# EAGLE design 113_ir_receive (EAGLE 9.6.0)
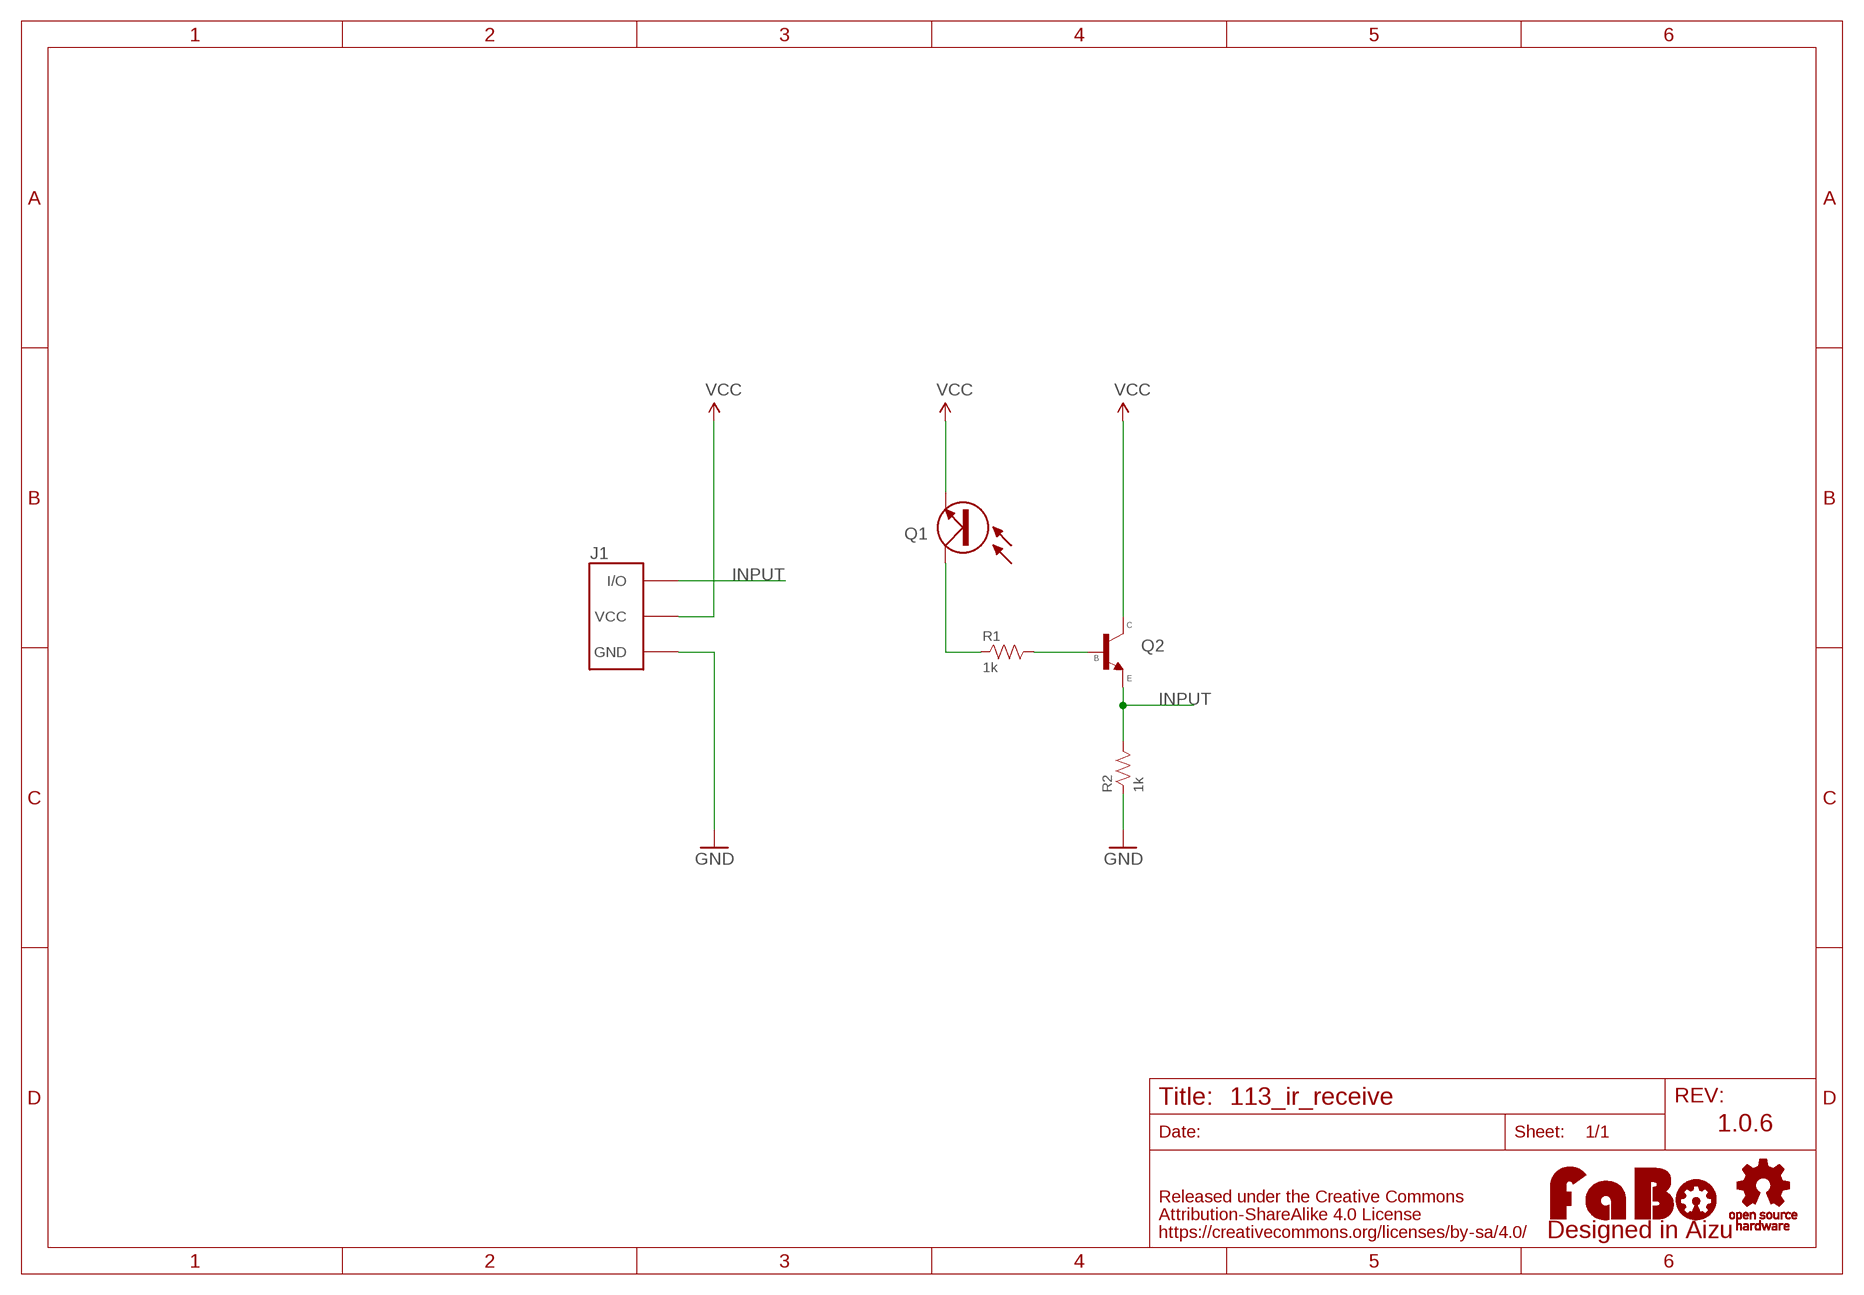
[diagram p0: schematic, sheet 1]

## Parts
J1  FABO_BRICK_3PIN  [FABO_BRICK_3PIN]
LOGO1  LOGO_FABO-M  [LOGO_FABO_M]
Q1  L-51ROPT1D1  [LED-5MM]
Q2  NPN-2SC1815  [TO-92]
R1  1k  RESISTOR-AXL-REGULAR  [AXL-REGULAR]
R2  1k  RESISTOR-AXL-REGULAR  [AXL-REGULAR]
U$6  LOGO_OSHW-M_BOTTOM  [LOGO_OSHW_M_BOTTOM]

## Nets
GND: J1.GND R2.1
INPUT: J1.I/O Q2.1(E) R2.2
N$5: Q1.K(C) R1.1
N$6: Q2.3(B) R1.2
VCC: J1.VCC Q1.A(E) Q2.2(C)

## Notes on the sheet
- 1.0.6

## Library data of the parts
J1 = FaBo-Template:FABO_BRICK_3PIN: FaBo Brick 3pin
LOGO1 = component:LOGO_FABO
Q1 = FaBo-Parts:L-51ROPT1D1
Q2 = FaBo-Parts:NPN
R1 R2 = FaBo-Resistors:RESISTOR: RESISTOR
U$6 = FaBo-etc:LOGO_OSHW

## Board
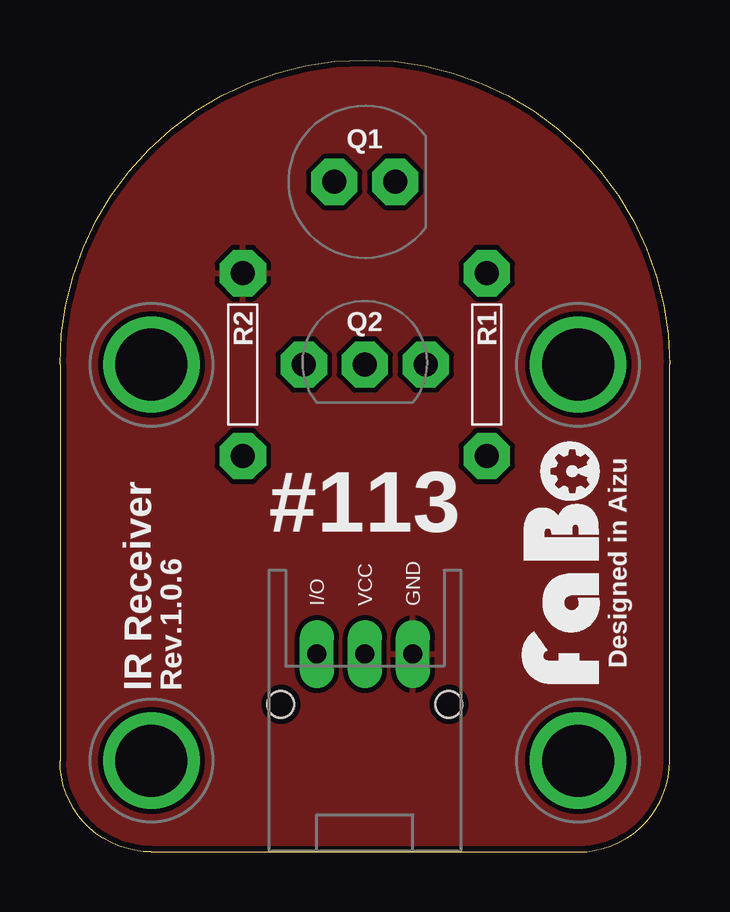
[diagram p1: board, top side]
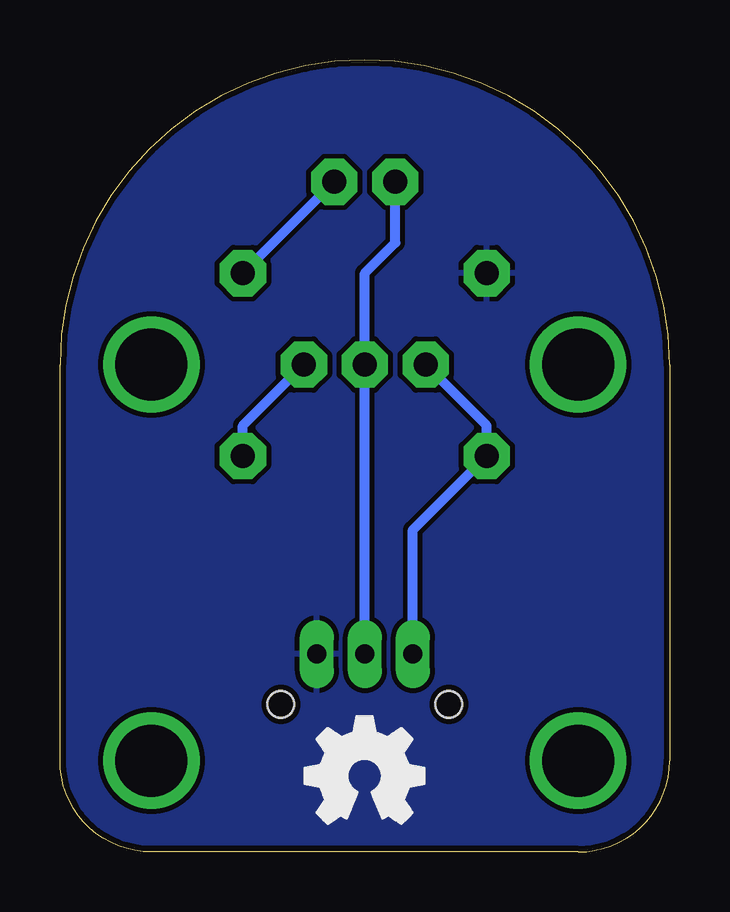
[diagram p2: board, bottom side, seen from below]

Size 25.4 x 33.02 mm. Coordinates in mm from the lower left corner, seen from the top.
Copper layers (1*16): Top 0.035mm / dielectric 1.6mm / Bottom 0.035mm
Design rules "PCBway": minimum track width 6mil, minimum drill 12mil, track to track 6mil, track to pad 6mil, pad to pad 6mil, via to via 6mil, smd to smd 6mil, copper to edge 10mil, drill to drill 10mil, minimum pad ring 10mil, minimum via ring 6mil, stop-mask expansion 2mil, vias tented up to drill 100mil, thermal gap 8mil

### Footprints (pad centres in the part's own frame; a part is rotated, then mirrored left to right if it is on the bottom)
FABO_BRICK_3PIN = drill 0.8 pad 1.422 long: GND 2,-8.255; I/O -2,-8.255; VCC 0,-8.255 | drill 3 pad 3.81: P$1 -8.89,3.81; P$2 8.89,3.81; P$3 -8.89,-12.7; P$4 8.89,-12.7 | hole 1.1: -3.5,-10.355; 3.5,-10.355
LED-5MM = drill 1 pad 1.93 octagon: A -1.27,0; K 1.27,0
TO-92 = drill 1 pad 1.93 octagon: 1 -2.54,0; 2 0,0; 3 2.54,0
AXL-REGULAR = drill 1 pad 1.93 octagon: 1 -3.81,0; 2 3.81,0

### Placement (x,y rotation side)
J1  12.7,16.51 0 top
LOGO1  22.86,12.06 90 top
Q1  12.7,27.94 0 top
Q2  12.7,20.32 0 top
R1  17.78,20.32 270 top
R2  7.62,20.32 270 top
U$6  12.7,3.17 0 top

### Tracks (layer width: path | path; a pad name or v marks a point on that pad's centre or on a via)
GND
  pour Bottom (isolate 0.203): 0,0 25.4,0 25.4,33.02 0,33.02
  pour Top (isolate 0.203): 0,0 25.4,0 25.4,33.02 0,33.02
INPUT
  Bottom 0.406: J1.I/O 10.7,13.43 R2.2 7.62,17.78 Q2.1
N$5
  Bottom 0.406: Q1.K R1.1
N$6
  Bottom 0.406: R1.2 17.78,17.78 Q2.3
VCC
  Bottom 0.406: J1.VCC Q2.2 12.7,24.13 11.43,25.4 Q1.A

### Text on the board
tPlace: #113 | Designed in Aizu | IR Receiver | Rev.1.0.6